# Altium schematic sheet usb.SchDoc
size A; DocumentNumber: 6; SheetNumber: 6; SheetTotal: 6
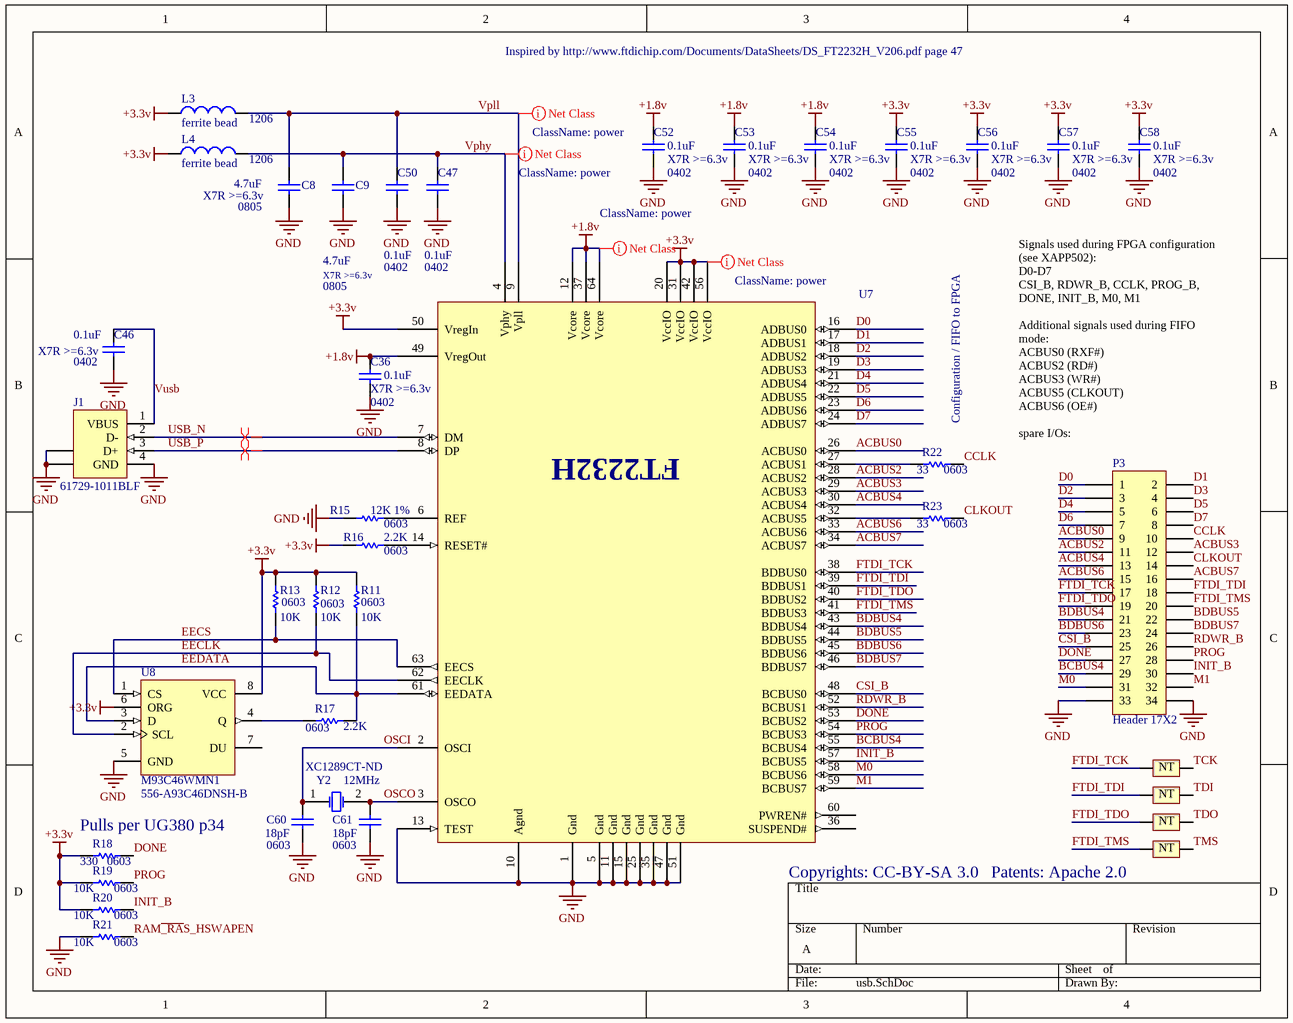
[diagram p0: usb.SchDoc]

## Parts
C8  value 4.7uF  PackageReference: 0805  Rating: X7R >=6.3v  [CAPC2012N]  (hidden comment: Cap Semi)
C9  value 4.7uF  PackageReference: 0805  Rating: X7R >=6.3v  [CAPC2012N]  (hidden comment: Cap Semi)
C36  value 0.1uF  PackageReference: 0402  Rating: X7R >=6.3v  [CAPC1005N]  (hidden comment: Cap Semi)
C46  value 0.1uF  PackageReference: 0402  Rating: X7R >=6.3v  [CAPC1005N]  (hidden comment: Cap Semi)
C47  value 0.1uF  PackageReference: 0402  [CAPC1005N]  (hidden comment: Cap Semi)
C50  value 0.1uF  PackageReference: 0402  [CAPC1005N]  (hidden comment: Cap Semi)
C52  value 0.1uF  PackageReference: 0402  Rating: X7R >=6.3v  [CAPC1005N]  (hidden comment: Cap Semi)
C53  value 0.1uF  PackageReference: 0402  Rating: X7R >=6.3v  [CAPC1005N]  (hidden comment: Cap Semi)
C54  value 0.1uF  PackageReference: 0402  Rating: X7R >=6.3v  [CAPC1005N]  (hidden comment: Cap Semi)
C55  value 0.1uF  PackageReference: 0402  Rating: X7R >=6.3v  [CAPC1005N]  (hidden comment: Cap Semi)
C56  value 0.1uF  PackageReference: 0402  Rating: X7R >=6.3v  [CAPC1005N]  (hidden comment: Cap Semi)
C57  value 0.1uF  PackageReference: 0402  Rating: X7R >=6.3v  [CAPC1005N]  (hidden comment: Cap Semi)
C58  value 0.1uF  PackageReference: 0402  Rating: X7R >=6.3v  [CAPC1005N]  (hidden comment: Cap Semi)
C60  value 18pF  PackageReference: 0603  [CAPC1608N]  (hidden comment: Cap Semi)
C61  value 18pF  PackageReference: 0603  [CAPC1608N]  (hidden comment: Cap Semi)
J1  value 61729-1011BLF  [1-1470156]  (hidden comment: 1-1470156-1)
L3  ferrite bead  PackageReference: 1206  [INDC3216AN]
L4  ferrite bead  PackageReference: 1206  [INDC3216AN]
NT2  Net Tie2  [NetTie 0603]  (value not drawn)  (net tie, no BOM)
NT3  Net Tie2  [NetTie 0603]  (value not drawn)  (net tie, no BOM)
NT4  Net Tie2  [NetTie 0603]  (value not drawn)  (net tie, no BOM)
NT5  Net Tie2  [NetTie 0603]  (value not drawn)  (net tie, no BOM)
P3  Header 17X2  [HDR2X17]  (no BOM)
R11  value 10K  PackageReference: 0603  [RESC1608N]  (hidden comment: Res Semi)
R12  value 10K  PackageReference: 0603  [RESC1608N]  (hidden comment: Res Semi)
R13  value 10K  PackageReference: 0603  [RESC1608N]  (hidden comment: Res Semi)
R15  value 12K 1%  PackageReference: 0603  [RESC1608N]  (hidden comment: Res Semi)
R16  value 2.2K  PackageReference: 0603  [RESC1608N]  (hidden comment: Res Semi)
R17  value 2.2K  PackageReference: 0603  [RESC1608N]  (hidden comment: Res Semi)
R18  value 330  PackageReference: 0603  [RESC1608N]  (hidden comment: Res Semi)
R19  value 10K  PackageReference: 0603  [RESC1608N]  (hidden comment: Res Semi)
R20  value 10K  PackageReference: 0603  [RESC1608N]  (hidden comment: Res Semi)
R21  value 10K  PackageReference: 0603  [RESC1608N]  (hidden comment: Res Semi)
R22  value 33  PackageReference: 0603  [RESC1608N]  (hidden comment: Res Semi)
R23  value 33  PackageReference: 0603  [RESC1608N]  (hidden comment: Res Semi)
U7  Component_1  [SQFP50P1200X1200X180-64N]  (value not drawn)
U8  M93C46WMN1  Supplier Part Number 1: 556-A93C46DNSH-B  [SOP8_N]
Y2  12MHz  Supplier Part Number 1: XC1289CT-ND  [HC49/4H_SMX]

## Nets
+1.8v: C36.2 C52.2 C53.2 C54.2 U7.12(Vcore) U7.37(Vcore) U7.49(VregOut) U7.64(Vcore)
+3.3v: C55.2 C56.2 C57.2 C58.2 L3.1 L4.1 R11.2 R12.2 R13.2 R16.1 R18.2 R19.1 R20.1 U7.20(VccIO) U7.31(VccIO) U7.42(VccIO) U7.50(VregIn) U7.56(VccIO) U8.6(ORG) U8.8(VCC)
GND: C8.1 C9.1 C36.1 C46.1 C47.1 C50.1 C52.1 C53.1 C54.1 C55.1 C56.1 C57.1 C58.1 C60.1 C61.1 J1.4(GND) J1.5(SHLD) J1.6(SHLD) P3.33 P3.34 R15.2 R21.1 U7.1(Gnd) U7.5(Gnd) U7.10(Agnd) U7.11(Gnd) U7.13(TEST) U7.15(Gnd) U7.25(Gnd) U7.35(Gnd) U7.47(Gnd) U7.51(Gnd) U8.5(GND)
ACBUS0: P3.9 U7.26(ACBUS0)
ACBUS2: P3.11 U7.28(ACBUS2)
ACBUS3: P3.12 U7.29(ACBUS3)
ACBUS4: P3.13 U7.30(ACBUS4)
ACBUS6: P3.15 U7.33(ACBUS6)
ACBUS7: P3.16 U7.34(ACBUS7)
BCBUS4: P3.29 U7.55(BCBUS4)
BDBUS4: P3.21 U7.43(BDBUS4)
BDBUS5: P3.22 U7.44(BDBUS5)
BDBUS6: P3.23 U7.45(BDBUS6)
BDBUS7: P3.24 U7.46(BDBUS7)
CCLK: P3.10 R22.2
CLKOUT: P3.14 R23.2
CSI_B: P3.25 U7.48(BCBUS0)
D0: P3.1 U7.16(ADBUS0)
D1: P3.2 U7.17(ADBUS1)
D2: P3.3 U7.18(ADBUS2)
D3: P3.4 U7.19(ADBUS3)
D4: P3.5 U7.21(ADBUS4)
D5: P3.6 U7.22(ADBUS5)
D6: P3.7 U7.23(ADBUS6)
D7: P3.8 U7.24(ADBUS7)
DONE: P3.27 R18.1 U7.53(BCBUS2)
EECLK: R12.1 U7.62(EECLK) U8.2(SCL)
EECS: R13.1 U7.63(EECS) U8.1(CS)
EEDATA: R11.1 R17.2 U7.61(EEDATA) U8.3(D)
FTDI_TCK: NT2.1 P3.17 U7.38(BDBUS0)
FTDI_TDI: NT3.1 P3.18 U7.39(BDBUS1)
FTDI_TDO: NT4.1 P3.19 U7.40(BDBUS2)
FTDI_TMS: NT5.1 P3.20 U7.41(BDBUS3)
INIT_B: P3.30 R20.2 U7.57(BCBUS5)
M0: P3.31 U7.58(BCBUS6)
M1: P3.32 U7.59(BCBUS7)
OSCI: C60.2 U7.2(OSCI) Y2.1(OSC1)
OSCO: C61.2 U7.3(OSCO) Y2.2(OSC2)
PROG: P3.28 R19.2 U7.54(BCBUS3)
RAM~{_RA}S_HSWAPEN: R21.2
RDWR_B: P3.26 U7.52(BCBUS1)
TCK: NT2.2
TDI: NT3.2
TDO: NT4.2
TMS: NT5.2
USB_N: J1.2(D-) U7.7(DM)
USB_P: J1.3(D+) U7.8(DP)
Vphy: C9.2 C47.2 L4.2 U7.4(Vphy)
Vpll: C8.2 C50.2 L3.2 U7.9(Vpll)
Vusb: C46.2 J1.1(VBUS)
NetR15_1: R15.1 U7.6(REF)
NetR16_2: R16.2 U7.14(RESET#)
NetR17_1: R17.1 U8.4(Q)
NetR22_1: R22.1 U7.27(ACBUS1)
NetR23_1: R23.1 U7.32(ACBUS5)

Not connected (* = marked no-connect by the designer): U7 36(SUSPEND#) 60(PWREN#); U8 7(DU)

## Layout directives
net class power: +1.8v, +3.3v, Vphy, Vpll
differential pair: USB_N, USB_P

## Notes on the sheet
- Inspired by http://www.ftdichip.com/Documents/DataSheets/DS_FT2232H_V206.pdf page 47
- (near R22) Configuration / FIFO to FPGA
- (near P3) Signals used during FPGA configuration (see XAPP502):
  D0-D7
  CSI_B, RDWR_B, CCLK, PROG_B, DONE, INIT_B, M0, M1
  Additional signals used during FIFO mode:
  ACBUS0 (RXF#)
  ACBUS2 (RD#)
  ACBUS3 (WR#)
  ACBUS5 (CLKOUT)
  ACBUS6 (OE#)
  spare I/Os:
- (near R18) Pulls per UG380 p34
- (near U7) Copyrights: CC-BY-SA 3.0
- (near NT5) Patents: Apache 2.0
- (in symbol Net Tie2) NT

## Library data of the parts
C8 C9 = Cap: Capacitor; Description: CAP CER 4.7UF 10V Y5V 0805; Tolerance: -20%, +80%; Substitutable: yes; Supplier 1: Digi-Key; Supplier Part Number 1: 445-1370-1-ND
C36 C46 C52-C58 = Cap Semi: Capacitor (Semiconductor SIM Model); Description: CAP CER 0.1UF 25V 10% X5R 0603; Tolerance: ±10%; Substitutable: yes; Supplier 1: Digi-Key; Supplier Part Number 1: 445-4703-1-ND; Supplier 2: Digi-Key; Supplier Part Number 2: 445-6854-1-ND
C47 C50 = Cap Semi: Capacitor (Semiconductor SIM Model); Description: CAP CER 0.1UF 25V 10% X5R 0603; Tolerance: ±10%; Rating: X7R >=6.3v; Substitutable: yes; Supplier 1: Digi-Key; Supplier Part Number 1: 445-4703-1-ND; Supplier 2: Digi-Key; Supplier Part Number 2: 445-6854-1-ND
C60 C61 = Cap Semi: Capacitor (Semiconductor SIM Model); Rating: C0G >=6.3v; Substitutable: yes; Supplier 1: Digi-Key; Supplier Part Number 1: 445-1777-1-ND
J1 = 1-1470156-1: USB 1.1, Right Angle, Thru-Hole, B Type, Receptacle, 4 Position, White; Substitutable: no; PackageReference: 1-1470156
L3 L4 = Inductor: VALUE: 0; Substitutable: yes; Supplier 1: Mouser; Supplier Part Number 1: 81-BLM18KG121TN1D
NT2-NT5 = Net Tie2: 0603 Net Tie to connect 2 different nets; Substitutable: DNP
P3 = Header 17X2: Header, 17-Pin, Dual row; Substitutable: DNP
R11-R13 R16-R23 = Res Semi: Semiconductor Resistor; Rating: 5%; Substitutable: yes
  R11-R13 R19-R21: Supplier 1: Digi-Key; Supplier Part Number 1: P10KGCT-ND
  R16 R17: Supplier 1: Digi-Key; Supplier Part Number 1: P2.2KGCT-ND
R15 = Res Semi: Semiconductor Resistor; Rating: 1%; Substitutable: yes; Supplier 1: Digi-Key; Supplier Part Number 1: P12.0KHCT-ND
U7 = Component_1: FT2232H; Substitutable: no; Supplier 1: Mouser; Supplier Part Number 1: 895-FT2232HL; PackageReference: QFP-64; Value: FT2232H
U8 = M93C46WMN1: 1Kb (x8/x16) Serial Microwire Bus EEPROM; Substitutable: no; PackageReference: SOP8; Supplier 1: Mouser; Value: M93C46WMN1
Y2 = XTAL: Crystal Oscillator; Substitutable: yes; PackageReference: HS-49; Value: 12 MHz; Supplier 1: Digi-Key